# EasyEDA schematic SCH_Card_Capacitive_without_capacitor_2025-09-15.json
TITLE: Sheet_1; REV: 1.0; Date: 2025-09-15; Sheet: 1/1; Company: Your Company
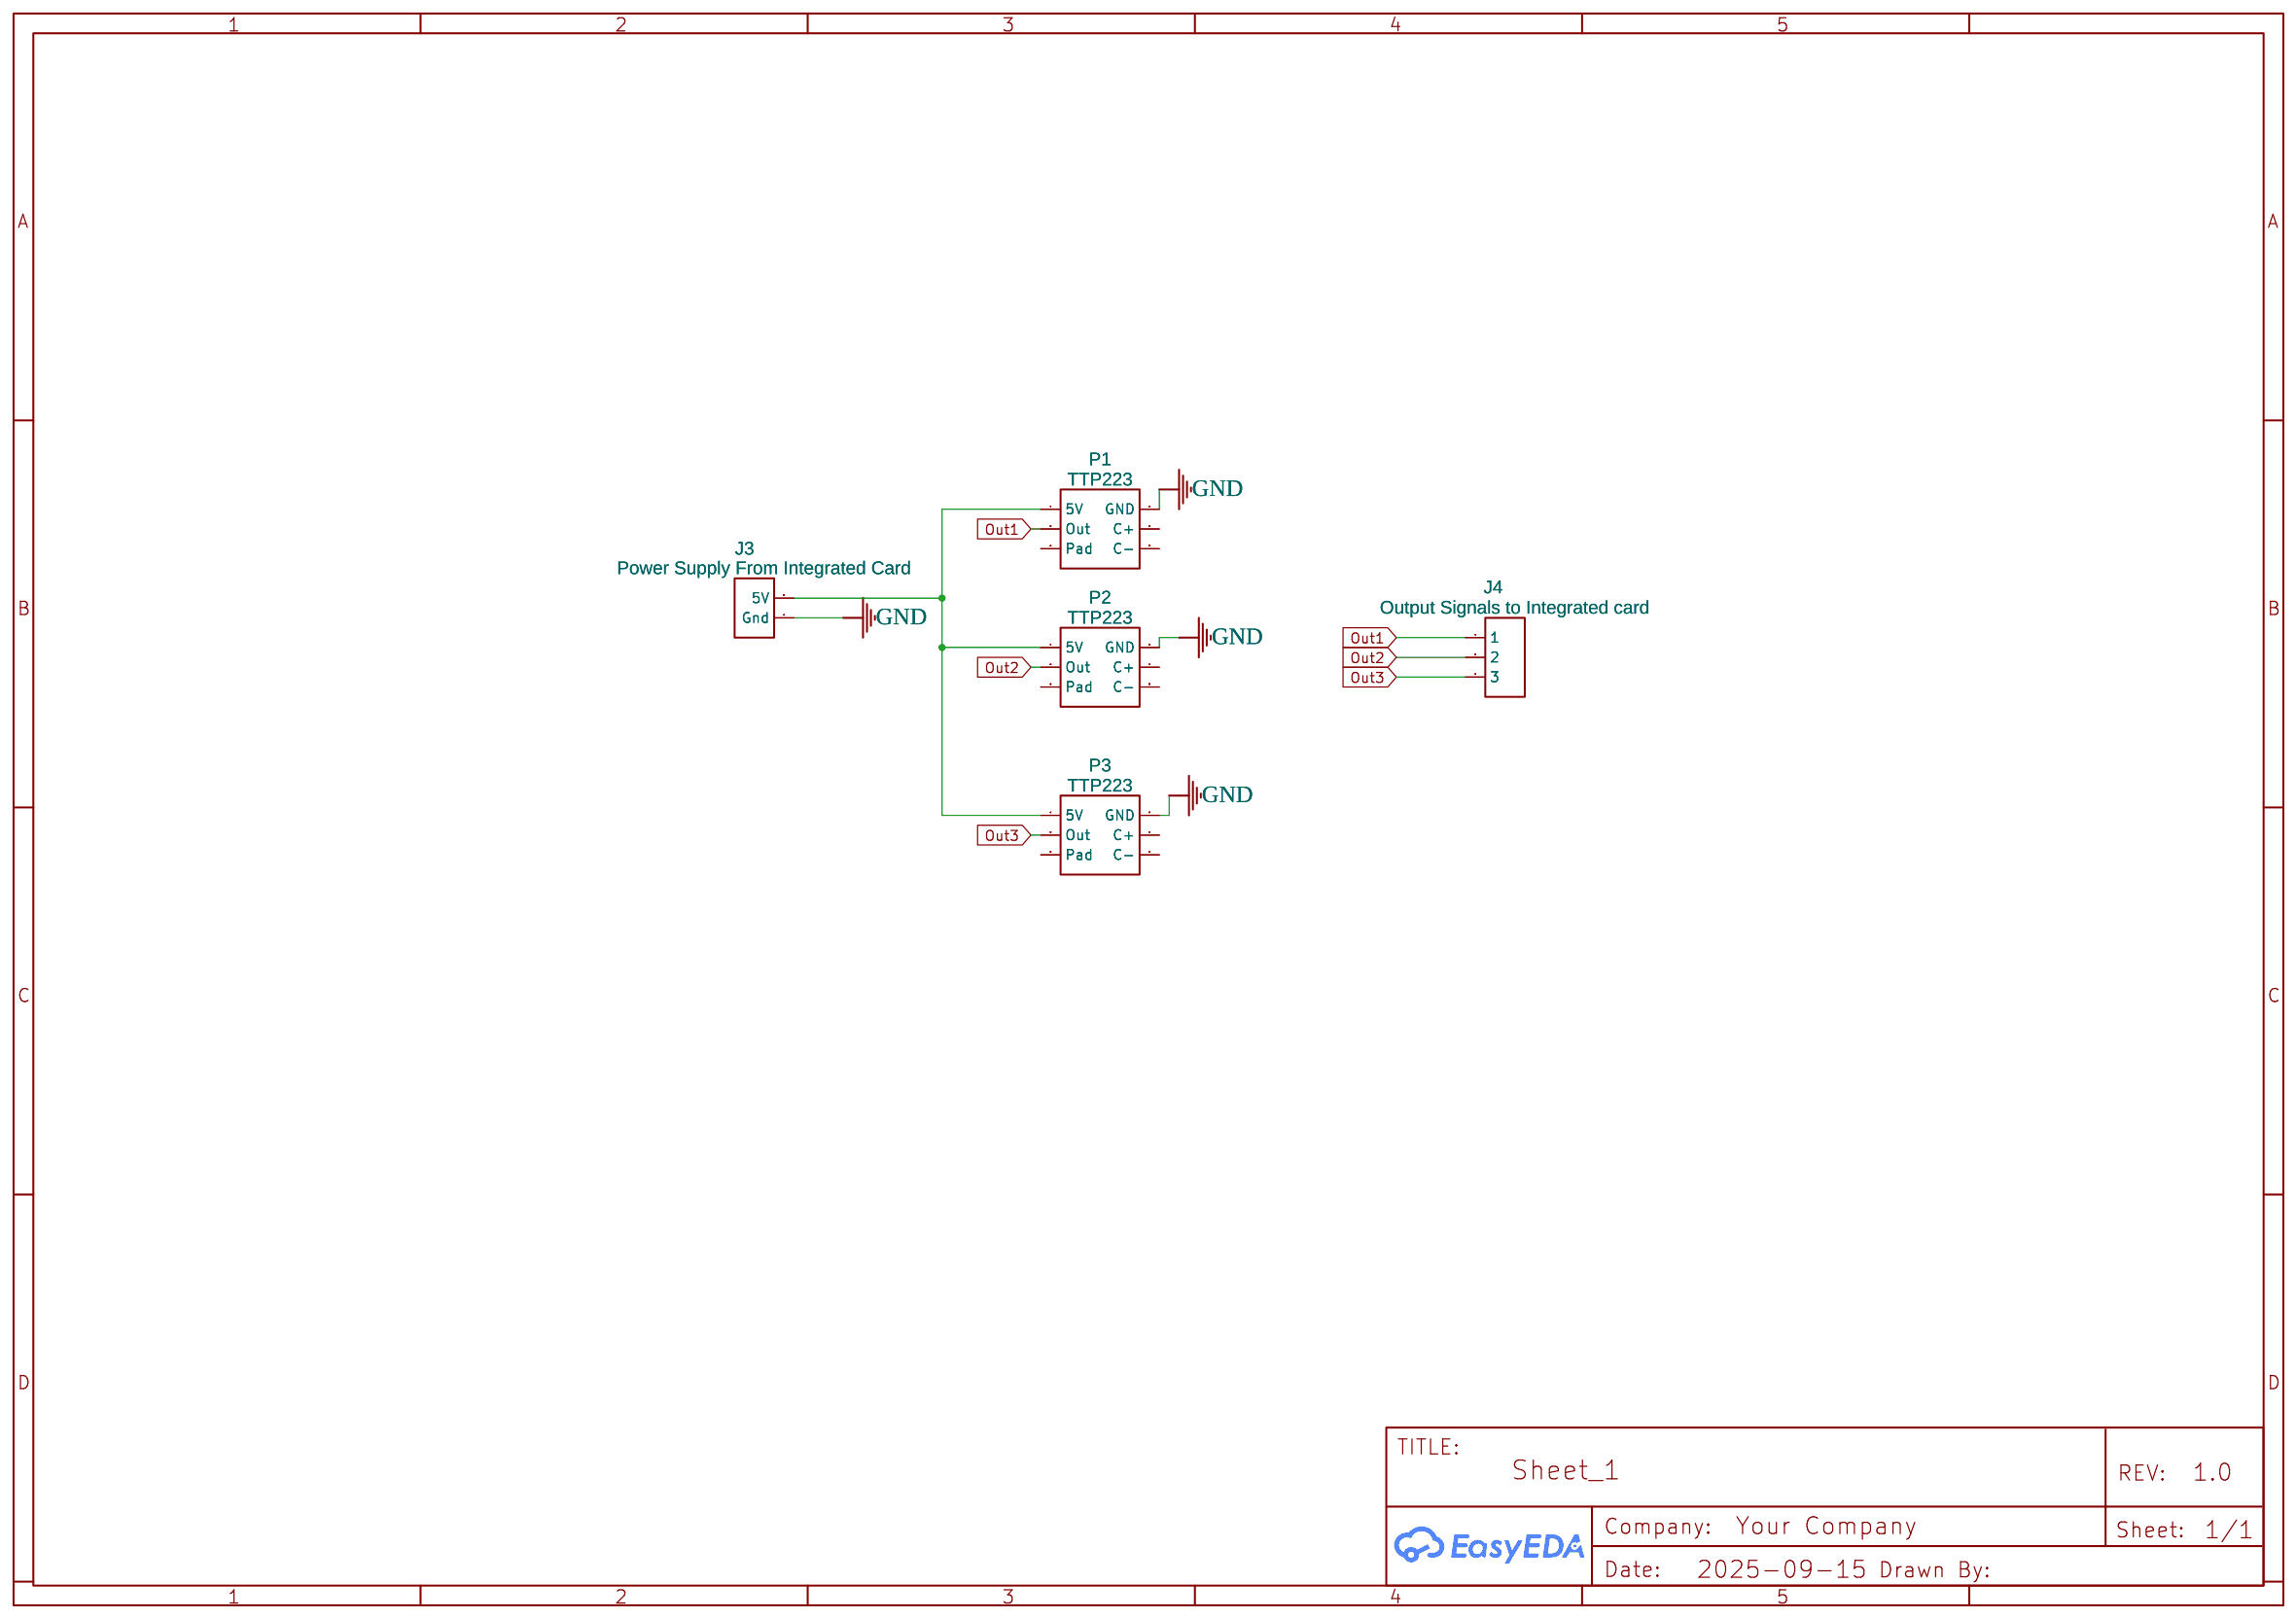
[diagram p0: schematic sheet]

## Parts
J3  Power Supply From Integrated Card  [HDR-M-2.54_1X2]
J4  Output Signals to Integrated card  [HDR-M-2.54_1X3]
P1  TTP223  [IDC-TH_6P-P2.54_C11214]
P2  TTP223  [IDC-TH_6P-P2.54_C11214]
P3  TTP223  [IDC-TH_6P-P2.54_C11214]

## Library data of the parts
J3 = HDR-M-2.54_1x2: Supplier Part: C124375; Supplier: LCSC; Contributor: LCEDA_Lib
J4 = HDR-M-2.54_1x3: Supplier Part: C180248; Supplier: LCSC; Contributor: LCEDA_Lib
P1-P3 = HDR-IDC-2.54-2X3P: Supplier: LCSC; Manufacturer: BOOMELE; Manufacturer Part: 2X3 2.54mm IDC Box; image: //image.lceda.cn/szlcsc/C11214.jpg; Supplier Part: C11214

## Nets
GND: J3.1(Gnd) P1.2(GND) P2.2(GND) P3.2(GND)
Out1: J4.1 P1.3(Out)
Out2: J4.2 P2.3(Out)
Out3: J4.3 P3.3(Out)
Net-(J3-2): J3.2(5V) P1.1(5V) P2.1(5V) P3.1(5V)

Not connected (* = marked no-connect by the designer): P1 4(C+) 5(Pad) 6(C-); P2 4(C+) 5(Pad) 6(C-); P3 4(C+) 5(Pad) 6(C-)
